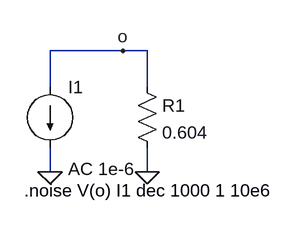
[diagram p0: schematic Draft4.asc]
Draft4.asc, the LTspice schematic file:
Version 4
SHEET 1 880 680
WIRE 128 64 32 64
WIRE 160 64 128 64
WIRE 32 112 32 64
WIRE 160 112 160 64
WIRE 32 224 32 192
WIRE 160 224 160 192
FLAG 160 224 0
FLAG 32 224 0
FLAG 128 64 o
SYMBOL res 144 96 R0
SYMATTR InstName R1
SYMATTR Value 0.604
SYMBOL current 32 112 R0
WINDOW 123 24 108 Left 2
WINDOW 39 0 0 Left 0
SYMATTR InstName I1
SYMATTR Value ""
SYMATTR Value2 AC 1e-6
TEXT -2 248 Left 2 !.noise V(o) I1 dec 1000 1 10e6

The netlist it stands for:
* Draft4.asc
R1 o 0 0.604
I1 o 0 AC 1e-6
.noise V(o) I1 dec 1000 1 10e6
.backanno
.end